# Altium schematic sheet Main.SchDoc: EE3102 Individual Project
size A4; Organization: Altium Limited; Address1: L3, 12a Rodborough Rd; Address2: Frenchs Forest; Address3: NSW; Address4: Australia 2086
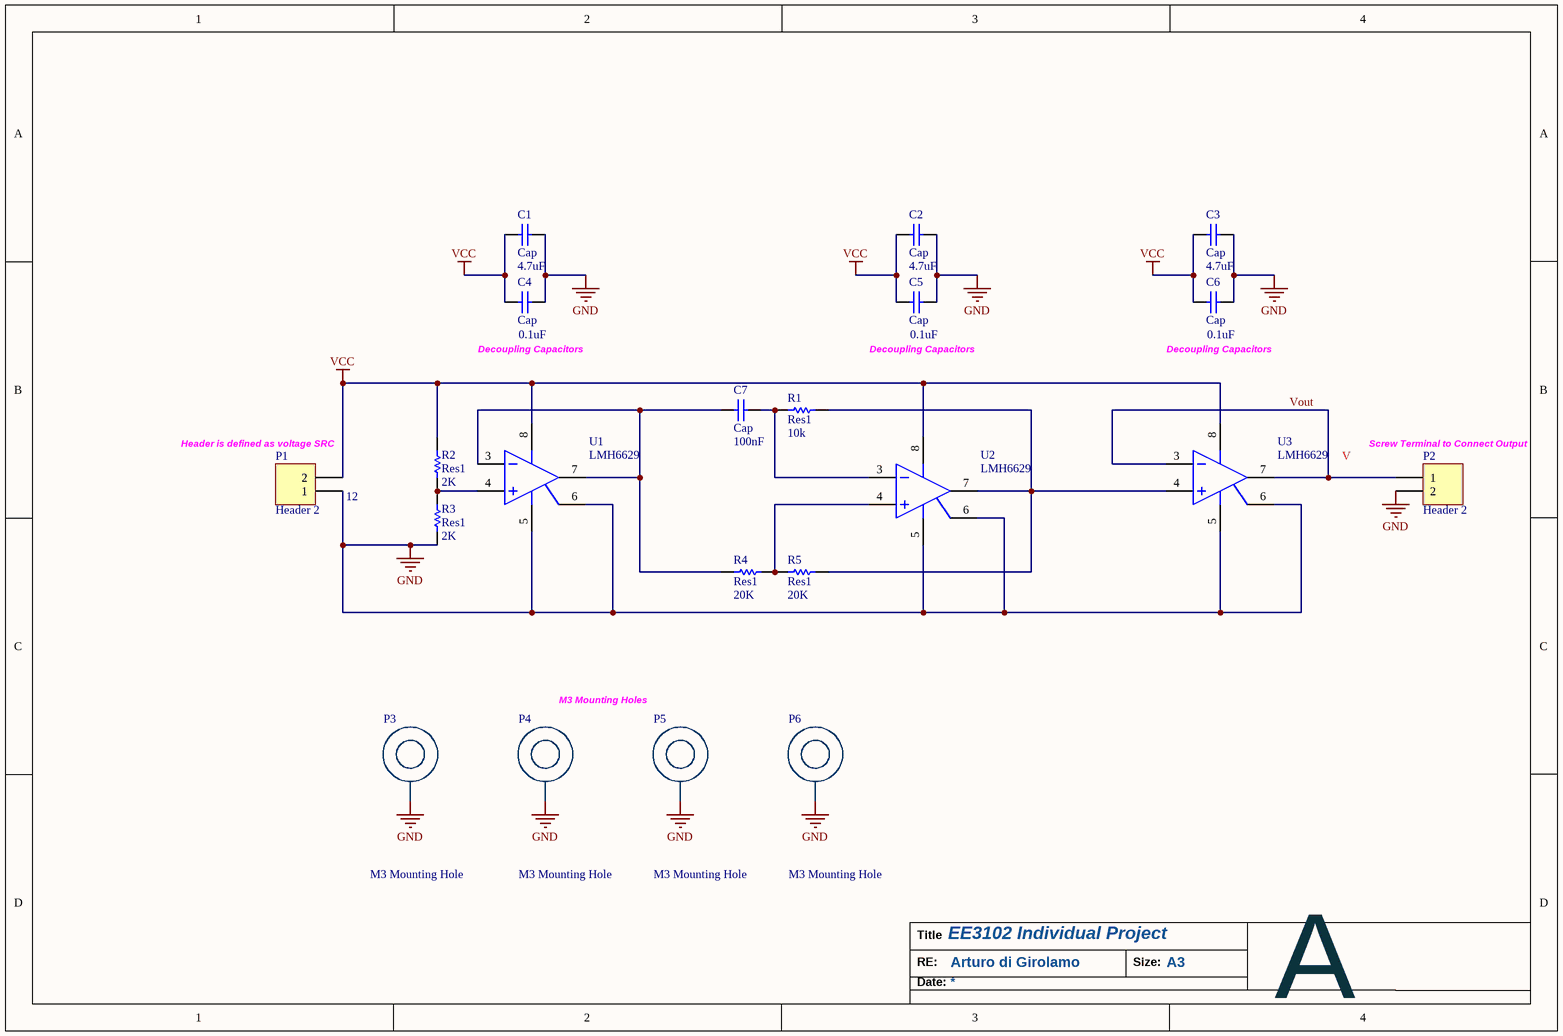
[diagram p0: Main.SchDoc]

## Parts
C1  Cap  value 4.7uF  [STD_0805_C]
C2  Cap  value 4.7uF  [STD_0805_C]
C3  Cap  value 4.7uF  [STD_0805_C]
C4  Cap  value 0.1uF  [STD_0805_C]
C5  Cap  value 0.1uF  [STD_0805_C]
C6  Cap  value 0.1uF  [STD_0805_C]
C7  Cap  value 100nF  [STD_0805_C]
P1  Header 2  value 12  [CUI_TB003-500-P02BE - duplicate]
P2  Header 2  [CUI_TB003-500-P02BE - duplicate]
P3  M3 Mounting Hole  [MH-M3]
P4  M3 Mounting Hole  [MH-M3]
P5  M3 Mounting Hole  [MH-M3]
P6  M3 Mounting Hole  [MH-M3]
R1  Res1  value 10k  [STD_0805_R]
R2  Res1  value 2K  [STD_0805_R]
R3  Res1  value 2K  [STD_0805_R]
R4  Res1  value 20K  [STD_0805_R]
R5  Res1  value 20K  [STD_0805_R]
U1  LMH6629  [LMH6629]
U2  LMH6629  [LMH6629]
U3  LMH6629  [LMH6629]

## Nets
GND: C1.2 C2.2 C3.2 C4.2 C5.2 C6.2 P1.1 P2.2 P3.1 P4.1 P5.1 P6.1 R3.1 U1.5(V-) U1.6(TAB) U2.5(V-) U2.6(TAB) U3.5(V-) U3.6(TAB)
VCC: C1.1 C2.1 C3.1 C4.1 C5.1 C6.1 P1.2 R2.2 U1.8(V+) U2.8(V+) U3.8(V+)
Vout: P2.1 U3.3(IN-) U3.7(OUT)
NetC7_1: C7.1 R4.1 U1.3(IN-) U1.7(OUT)
NetC7_2: C7.2 R1.1 U2.3(IN-)
NetR1_2: R1.2 R5.2 U2.7(OUT) U3.4(IN+)
NetR2_1: R2.1 R3.2 U1.4(IN+)
NetR4_2: R4.2 R5.1 U2.4(IN+)

## Notes on the sheet
- (near C4) Decoupling Capacitors
- (near C5) Decoupling Capacitors
- (near C6) Decoupling Capacitors
- (near P1) Header is defined as voltage SRC
- (near P2) Screw Terminal to Connect Output
- M3 Mounting Holes
- Title
- Date:
- RE:
- Arturo di Girolamo
- Size:
- A3
- A

## Library data of the parts
C1-C7 = Cap: Capacitor; Published: 8-Jun-2000; LatestRevisionDate: 17-Jul-2002; LatestRevisionNote: Re-released for DXP Platform.; PackageReference: RAD-0.3; Publisher: Altium Limited; PackageDescription: Radial Cap, Thru-Hole; 2 Leads; 0.3 in Pin Spacing
P1 P2 = Header 2: Header, 2-Pin; LatestRevisionDate: 17-Jul-2002; LatestRevisionNote: Re-released for DXP Platform.; Publisher: Altium Limited
P3-P6 = MH-M3
R1-R5 = Res1: Resistor; Published: 8-Jun-2000; LatestRevisionDate: 17-Jul-2002; LatestRevisionNote: Re-released for DXP Platform.; PackageReference: AXIAL-0.3; Publisher: Altium Limited; PackageDescription: Axial Device, Thru-Hole; 2 Leads; 0.3 in Pin Spacing